# Altium schematic sheet AntDig.SchDoc
size 420 x 297 mm; Author: ALTIUM GOSTBOM2.0 KEV; SheetNumber: 1; SheetTotal: 1
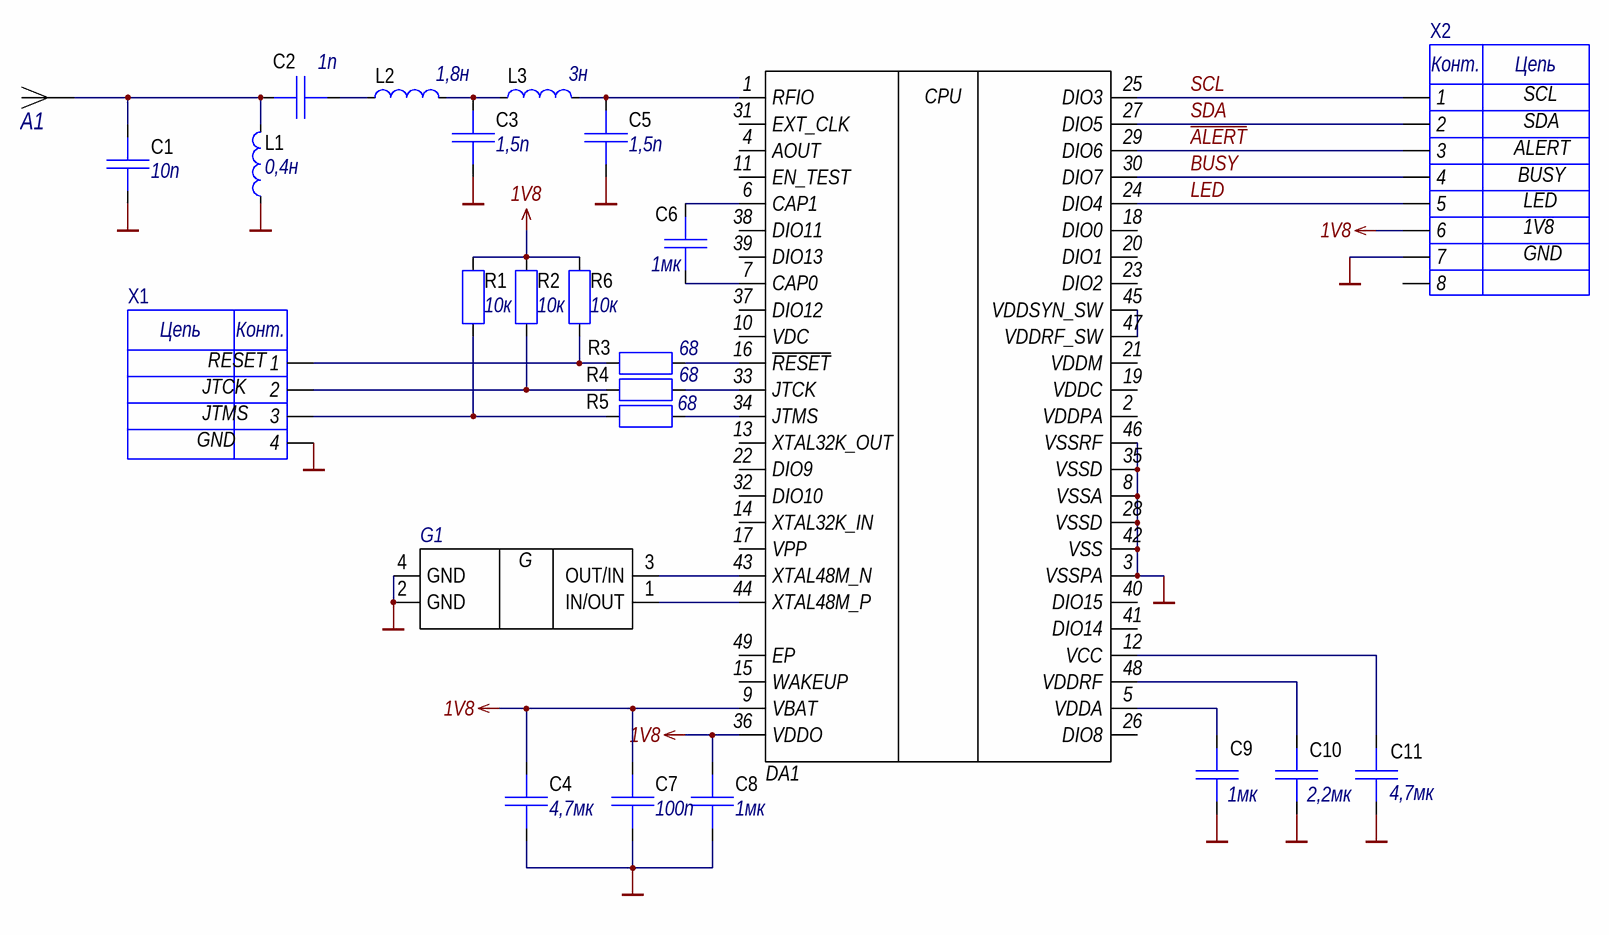
[diagram p0: AntDig.SchDoc]

## Parts
A1  Обозначение при заказе  [antenna]  (value not drawn)
C1  10п  [cap0402]
C2  1п  [cap0402]
C3  1,5п  [cap0402]
C4  4,7мк  [cap0402]
C5  1,5п  [cap0402]
C6  1мк  [cap0402]
C7  100п  [cap0402]
C8  1мк  [cap0402]
C9  1мк  [cap0402]
C10  2,2мк  [cap0402]
C11  4,7мк  [cap0402]
DA1  RSL10  [RSL10]  (value not drawn)
G1  Обозначение при заказе  [XTAL48]  (value not drawn)
L1  0,4н  [IND0402]
L2  1,8н  [IND0402]
L3  3н  [IND0402]
R1  10к  [Res0603]
R2  10к  [Res0603]
R3  68  [Res0603]
R4  68  [Res0603]
R5  68  [Res0603]
R6  10к  [Res0603]
X1  (no value)  [PSL_4]
X2  (no value)  [FFC8]

## Nets
1V8: C4.2 C7.2 C8.2 DA1.9(VBAT) DA1.36(VDDO) R1.1 R2.1 R6.1 X2.6
GND: C1.1 C3.1 C4.1 C5.1 C7.1 C8.1 C9.1 C10.1 C11.1 DA1.3(VSSPA) DA1.8(VSSA) DA1.28(VSSD) DA1.35(VSSD) DA1.42(VSS) DA1.46(VSSRF) G1.2(GND) G1.4(GND) L1.1 X1.4 X2.7
~{ALERT}: DA1.29(DIO6) X2.3
BUSY: DA1.30(DIO7) X2.4
LED: DA1.24(DIO4) X2.5
SCL: DA1.25(DIO3) X2.1
SDA: DA1.27(DIO5) X2.2
NetA1_1: A1.1 C1.2 C2.2 L1.2
NetC2_1: C2.1 L2.1
NetC3_2: C3.2 L2.2 L3.1
NetC5_2: C5.2 DA1.1(RFIO) L3.2
NetC6_1: C6.1 DA1.7(CAP0)
NetC6_2: C6.2 DA1.6(CAP1)
NetC9_2: C9.2 DA1.5(VDDA)
NetC10_2: C10.2 DA1.48(VDDRF)
NetC11_2: C11.2 DA1.12(VCC)
NetDA1_16: DA1.16(~{RESET}) R3.1
NetDA1_33: DA1.33(JTCK) R4.1
NetDA1_34: DA1.34(JTMS) R5.1
NetDA1_43: DA1.43(XTAL48M_N) G1.3(OUT/IN)
NetDA1_44: DA1.44(XTAL48M_P) G1.1(IN/OUT)
NetDA1_45: DA1.45(VDDSYN_SW) DA1.47(VDDRF_SW)
NetR1_2: R1.2 R5.2 X1.3
NetR2_2: R2.2 R4.2 X1.2
NetR3_2: R3.2 R6.2 X1.1

Not connected (* = marked no-connect by the designer): DA1 2(VDDPA) 4(AOUT) 10(VDC) 11(EN_TEST) 13(XTAL32K_OUT) 14(XTAL32K_IN) 15(WAKEUP) 17(VPP) 18(DIO0) 19(VDDC) 20(DIO1) 21(VDDM) 22(DIO9) 23(DIO2) 26(DIO8) 31(EXT_CLK) 32(DIO10) 37(DIO12) 38(DIO11) 39(DIO13) 40(DIO15) 41(DIO14) 49(EP); X2 8

## Notes on the sheet
- SCL
- SDA
- ALERT
- BUSY
- LED
- 1V8
- GND
- Перв. примен.
- Справ. №
- Подп. дата
- Инв. № дубл.
- Взам. инв. №
- Подп. и дата
- Изм.
- Разраб.
- Лист
- № докум.
- Подп.
- Дата
- Лит.
- Масса
- Масштаб
- Пров.
- Т.контр.
- Листов
- Инв. № подл.
- Н.контр.
- Утв.
- ALTIUM GOSTBOM2.0 KEV
- Файл:
- Копировал
- Формат А3
- (in symbol FFC8) Конт.; Цепь
- (in symbol PSL4) Цепь; Конт.; RESET; JTCK; JTMS; GND
- (in symbol RSL10) CPU
- (in symbol XTAL48) G

## Library data of the parts
A1 = antenna: Описание свойств компонента
C1 = CapCer: Керамический конденсатор; manufacture: ОЖО.460.107ТУ; name_main: GRM1535C1H100J; Units: Ф; Name: Керамический конденсатор; Value: 10п
C2 = CapCer: Керамический конденсатор; manufacture: ОЖО.460.107ТУ; name_main: GRM1555C1H1R0BA01D; Units: Ф; Name: Керамический конденсатор; Value: 1п
C3 C5 = CapCer: Керамический конденсатор; manufacture: ОЖО.460.107ТУ; name_main: CL10C1R5CB8NNNC; Units: Ф; Name: Керамический конденсатор; Value: 1,5п
C4 C11 = CapCer: Керамический конденсатор; manufacture: ОЖО.460.107ТУ; name_main: GRM21BR60J335K; Units: Ф; Name: Керамический конденсатор; Value: 4,7мк
C6 C8 C9 = CapCer: Керамический конденсатор; manufacture: ОЖО.460.107ТУ; nameSuf: -3; name_main: CC0603KRX7R7BB105; Units: Ф; Name: Керамический конденсатор; Value: 1мк
C7 = CapCer: Керамический конденсатор; manufacture: ОЖО.460.107ТУ; name_main: GRM1885C1H101J; Units: Ф; Name: Керамический конденсатор; Value: 100п
C10 = CapCer: Керамический конденсатор; manufacture: ОЖО.460.107ТУ; name_main: GRM188R61A225K; Units: Ф; Name: Керамический конденсатор; Value: 2,2мк
G1 = XTAL48: ECS-480-8-47-JTN-TR
L1-L3 = Ind: Катушка индуктивности; Units: Гн; name_main: MLZ1608M100WT000; Name: Катушка индуктивности
  L1: Value: 0,4н
  L2: Value: 1,8н
  L3: Value: 3н
R1 R2 R6 = Res: Резистор; Manufacturer: АЛЯР.434110.005ТУ; Tolerance: 5%; name_main: RC0603FR-0710KL; Name: Резистор; Value: 10к
R3-R5 = Res: Резистор; Manufacturer: АЛЯР.434110.005ТУ; name_main: AC0603FR-0768RL; Name: Резистор; Value: 68
X1 = PSL4: manufacture: БСАР.430420.014ТУ; name: Разъемы; name_main: PLS-6
X2 = FFC8: manufacture: 2328702-8; name: Разъемы; name_main: FFC-8